# Altium schematic sheet raspi.SchDoc
size A4
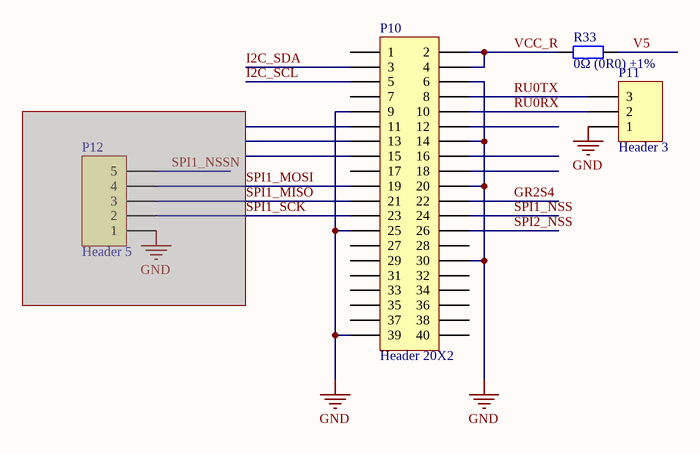
[diagram p0: raspi.SchDoc]

## Parts
P10  Header 20X2  [HDR2X20]
P11  Header 3  [HDR1X3]
P12  Header 5  [HDR1X5]  (masked out: inside a compile mask, not in the netlist)
R33  0Ω (0R0) ±1%  [1206_R]

## Nets
GND: P10.6 P10.9 P10.14 P10.20 P10.25 P10.30 P10.39 P11.1
GR2S4: P10.22
I2C_SCL: P10.5
I2C_SDA: P10.3
RU0RX: P10.10 P11.2
RU0TX: P10.8 P11.3
SPI1_NSS: P10.24
SPI2_NSS: P10.26
V5: R33.2
VCC_R: P10.2 P10.4 R33.1

Not connected (* = marked no-connect by the designer): P10 1 7 11 12 13 15 16 17 18 19 21 23 27 28 29 31 32 33 34 35 36 37 38 40

## Library data of the parts
P10 = Header 20X2: Header, 20-Pin, Dual row; LatestRevisionDate: 17-Jul-2002; LatestRevisionNote: Re-released for DXP Platform.; Publisher: Altium Limited
P11 = Header 3: Header, 3-Pin; LatestRevisionDate: 17-Jul-2002; LatestRevisionNote: Re-released for DXP Platform.; Publisher: Altium Limited
P12 = Header 5: Header, 5-Pin; LatestRevisionDate: 17-Jul-2002; LatestRevisionNote: Re-released for DXP Platform.; Publisher: Altium Limited
R33 = 1206 0Ω (0R0) 1%: 贴片电阻; ComponentLink1Description: 供应商链接; ComponentLink1URL: http://www.szlcsc.com/product/details_18576.html; Package: 1206; Supplier: LC; SuppliersPartNumber: C17888